# EAGLE design LeCoolStick-MainShield_v1 (EAGLE 7.3.0)
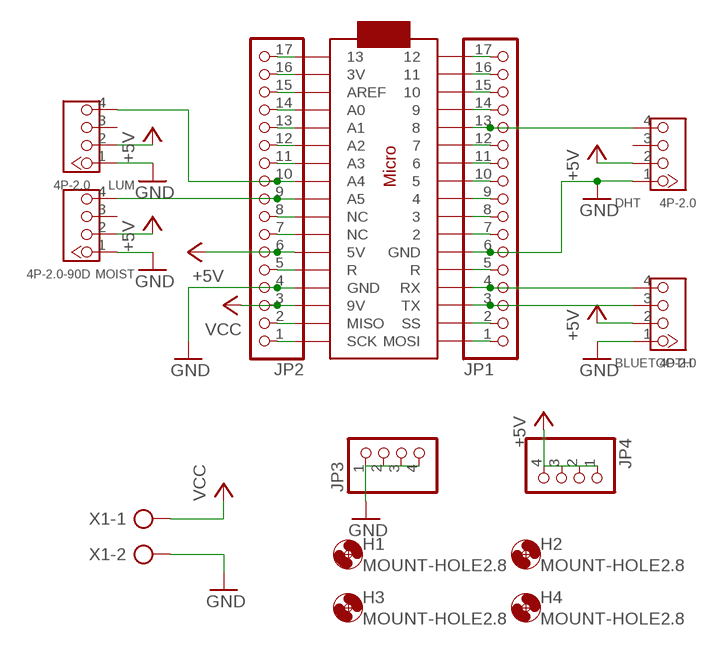
[diagram p0: schematic, sheet 1]

## Parts
BLUETOOTH  4P-2.0  GROVE-CONNECTOR-DIP(4P-2.0)  [HW4-2.0]
DHT  4P-2.0  GROVE-CONNECTOR-DIP(4P-2.0)  [HW4-2.0]
H1  MOUNT-HOLE2.8  [2,8]
H2  MOUNT-HOLE2.8  [2,8]
H3  MOUNT-HOLE2.8  [2,8]
H4  MOUNT-HOLE2.8  [2,8]
JP1  PINHD-1X17  [1X17]
JP2  PINHD-1X17  [1X17]
JP3  PINHD-1X4  [1X04]
JP4  PINHD-1X4  [1X04]
LUM  4P-2.0  GROVE-CONNECTOR-DIP(4P-2.0)  [HW4-2.0]
MOIST  4P-2.0-90D  GROVE-CONNECTOR-DIP-90D(4P-2.0)  [HW4-2.0-90D]
U$1  ARDUINOMICRO  [ARDUINOMICRO]
X1  AK500/2  [AK500/2]

## Nets
+5V: BLUETOOTH.2 DHT.2 JP2.6 JP4.1 JP4.2 JP4.3 JP4.4 LUM.2 MOIST.2 U$1.P$23(5V)
GND: BLUETOOTH.1 DHT.1 JP1.6 JP2.4 JP3.1 JP3.2 JP3.3 JP3.4 LUM.1 MOIST.1 U$1.P$12(GND) U$1.P$21(GND) X1.2
N$1: JP2.9 MOIST.4 U$1.P$26(A5)
N$2: JP2.10 LUM.4 U$1.P$27(A4)
N$3: DHT.4 JP1.13 U$1.P$5
N$4: BLUETOOTH.4 JP1.4 U$1.P$14(RX)
N$5: BLUETOOTH.3 JP1.3 U$1.P$15(TX)
N$6: JP1.1 U$1.P$17(MOSI)
N$7: JP1.2 U$1.P$16(SS)
N$8: JP1.5 U$1.P$22(R)
N$10: JP1.7 U$1.P$11
N$11: JP1.8 U$1.P$10
N$12: JP1.9 U$1.P$9
N$13: JP1.10 U$1.P$8
N$14: JP1.11 U$1.P$7
N$15: JP1.12 U$1.P$6
N$16: JP1.14 U$1.P$4
N$17: JP1.15 U$1.P$3
N$18: JP1.16 U$1.P$2
N$19: JP1.17 U$1.P$1
N$20: JP2.1 U$1.P$18(SCK)
N$21: JP2.2 U$1.P$19(MISO)
N$22: JP2.5 U$1.P$13(R)
N$24: JP2.7 U$1.P$24(NC)
N$25: JP2.8 U$1.P$25(NC)
N$26: JP2.11 U$1.P$28(A3)
N$27: JP2.12 U$1.P$29(A2)
N$28: JP2.13 U$1.P$30(A1)
N$29: JP2.14 U$1.P$31(A0)
N$30: JP2.15 U$1.P$32(AREF)
N$31: JP2.16 U$1.P$33(3V)
N$32: JP2.17 U$1.P$34
VCC: JP2.3 U$1.P$20(9V) X1.1
Unconnected: DHT.3 LUM.3 MOIST.3

## Library data of the parts
BLUETOOTH DHT LUM = Seeed-OPL-Connector:GROVE-CONNECTOR-DIP(4P-2.0): 320110033
H1-H4 = holes:MOUNT-HOLE: MOUNTING HOLE with drill center marker
JP1 JP2 = pinhead:PINHD-1X17: PIN HEADER
JP3 JP4 = pinhead:PINHD-1X4: PIN HEADER
MOIST = Seeed-OPL-Connector:GROVE-CONNECTOR-DIP-90D(4P-2.0): 320110034
U$1 = adafruit:ARDUINOMICRO
X1 = con-ptr500:AK500/2: CONNECTOR; OC_FARNELL: unknown; OC_NEWARK: unknown

## Board
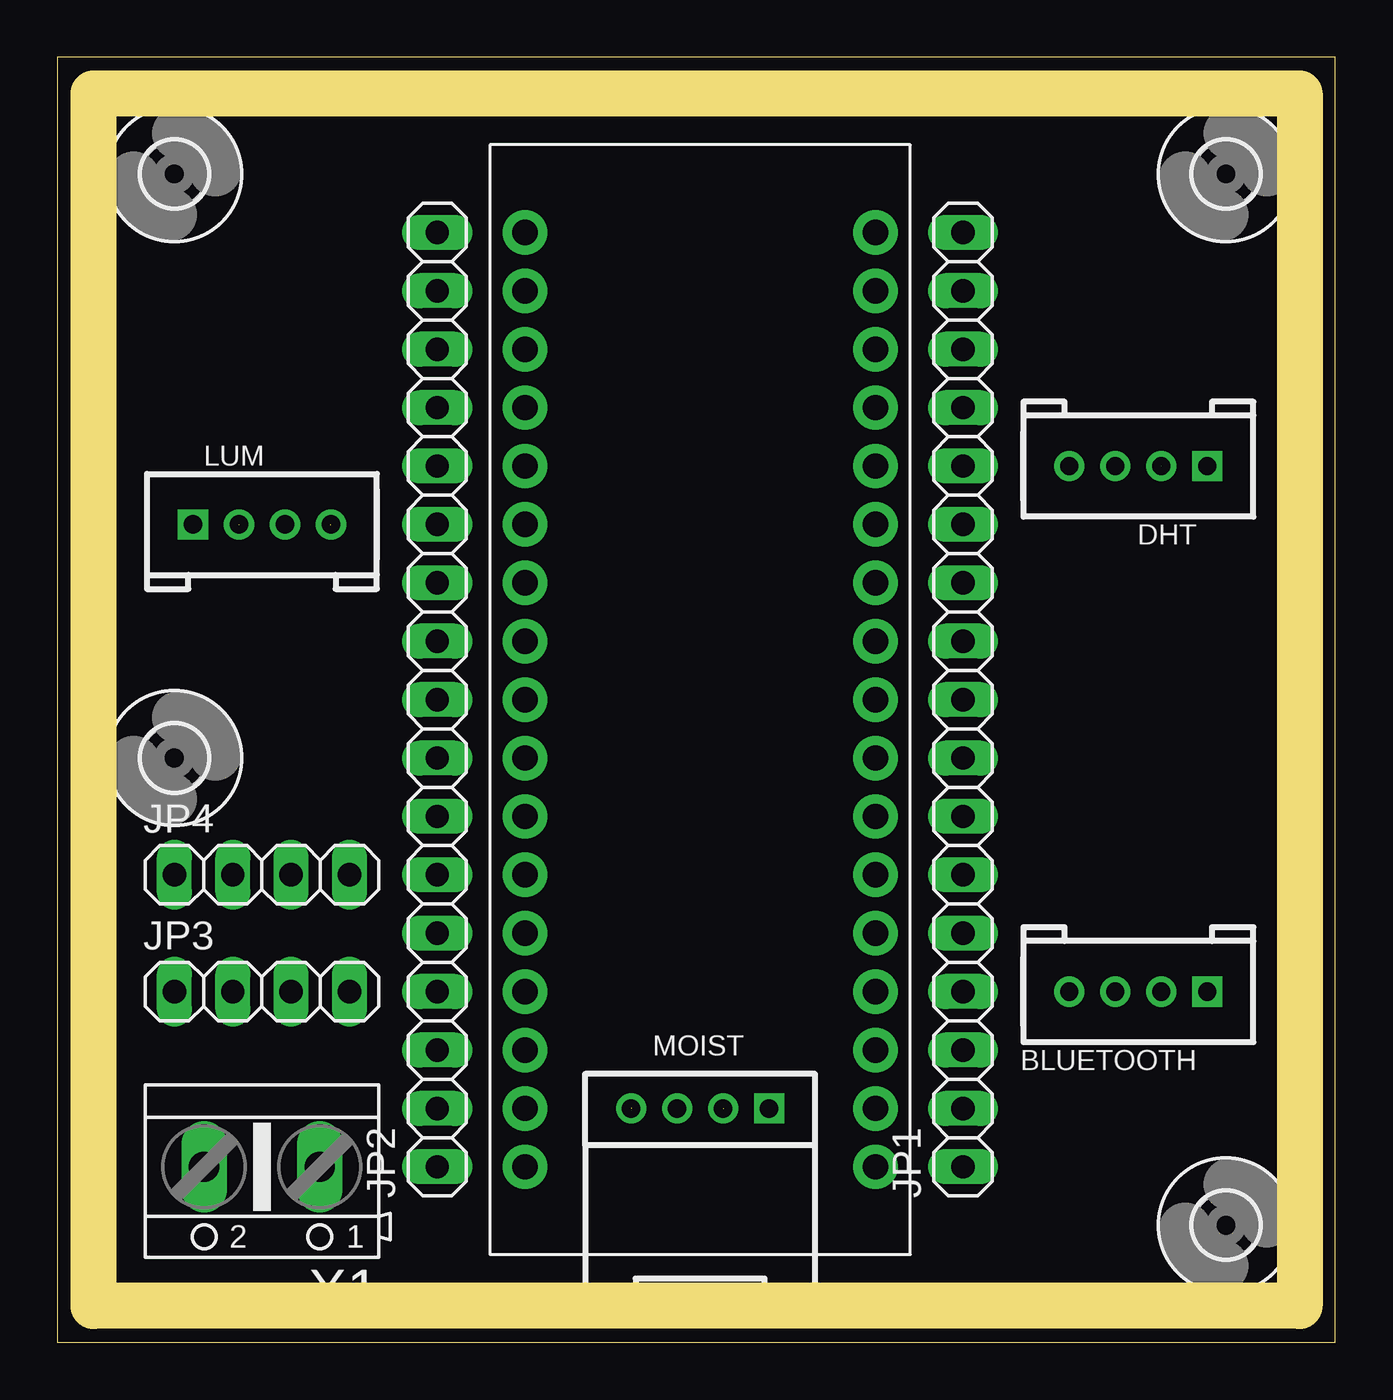
[diagram p1: board, top side]
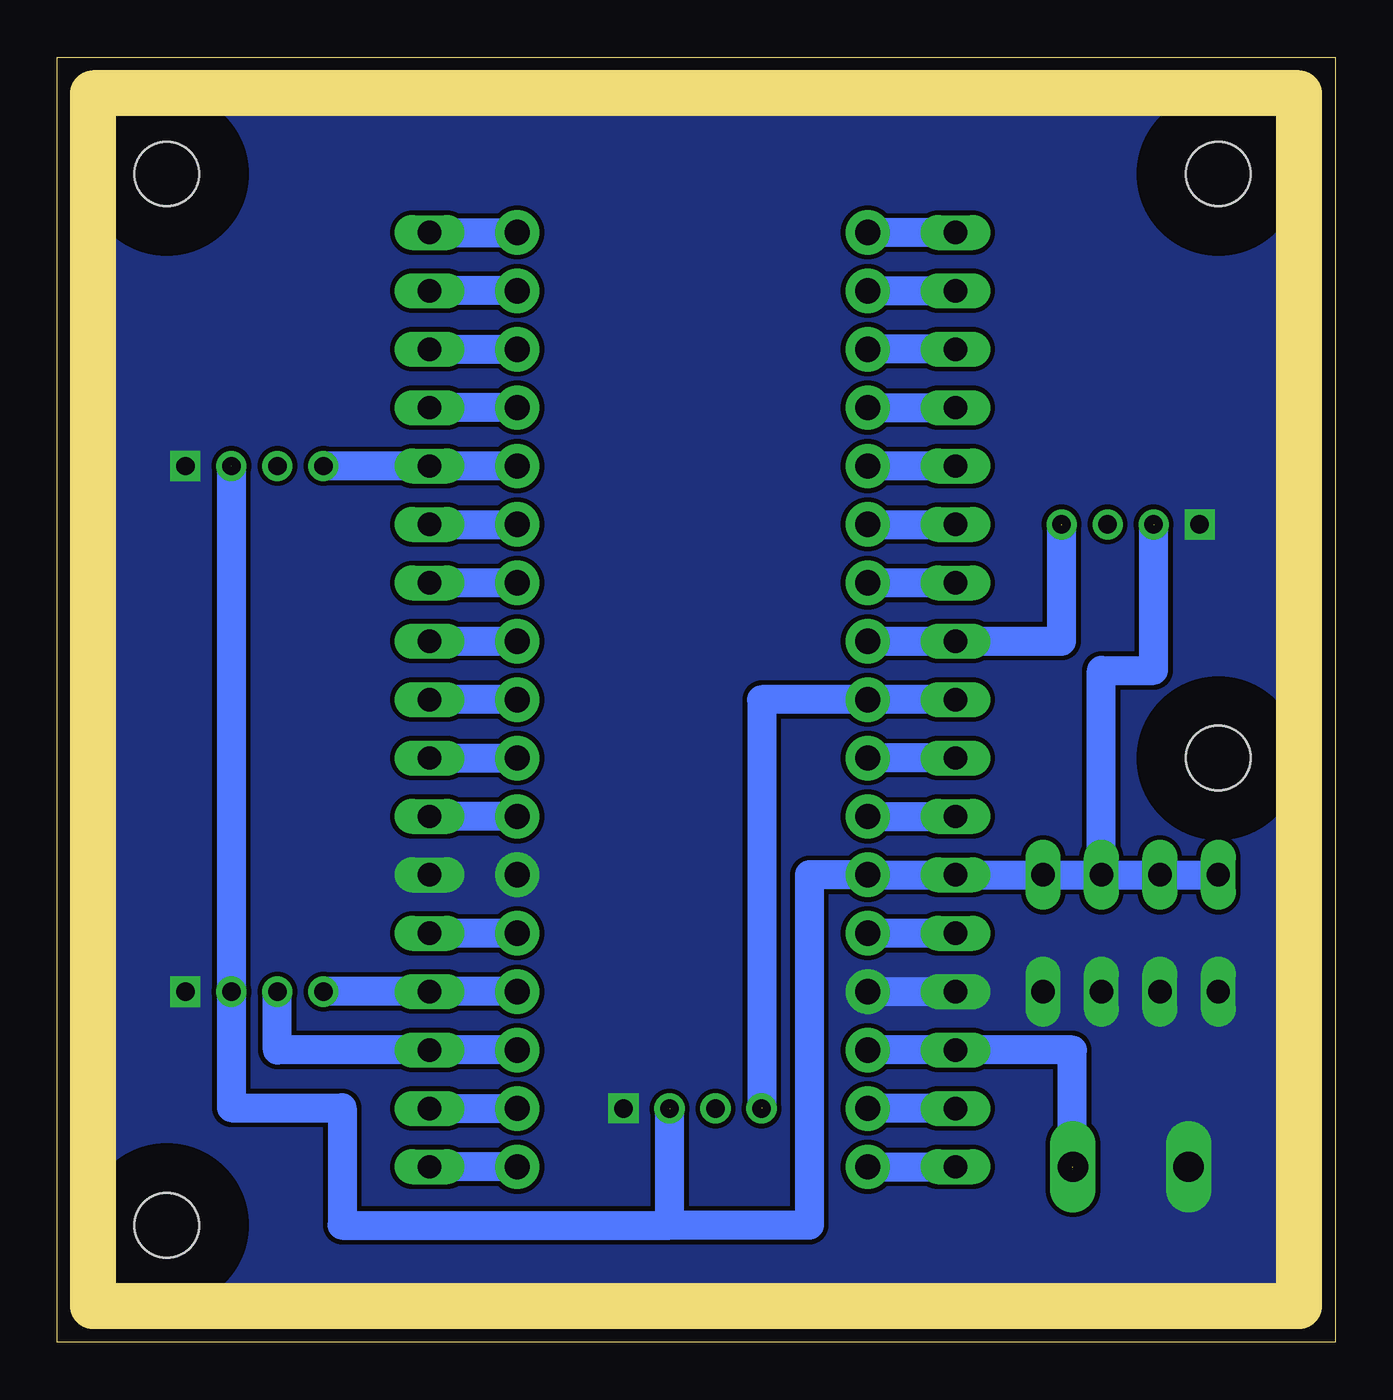
[diagram p2: board, bottom side, seen from below]

Size 55.55 x 55.87 mm. Coordinates in mm from the lower left corner, seen from the top.
Outline: 0,0 55.55,0 55.55,55.87 0,55.87 0,0
Copper layers (1*16): Top 0.035mm / dielectric 1.5mm / Bottom 0.035mm
Design rules "default": minimum track width 10mil, minimum drill 24mil, track to track 8mil, track to pad 8mil, pad to pad 8mil, via to via 8mil, smd to smd 8mil, copper to edge 40mil, drill to drill 8mil, minimum pad ring 10mil, minimum via ring 8mil, stop-mask expansion 4mil, vias tented up to drill 0mil, thermal gap 10mil
Milling: 4 lines

### Footprints (pad centres in the part's own frame; a part is rotated, then mirrored left to right if it is on the bottom)
HW4-2.0 = drill 0.8 pad 1.27 square: 1 -3,0 | drill 0.8 pad 1.27: 2 -1,0; 3 1,0; 4 3,0
2,8 = hole 2.8: 0,0
1X17 = drill 1.016 long: 1 -20.32,0; 2 -17.78,0; 3 -15.24,0; 4 -12.7,0; 5 -10.16,0; 6 -7.62,0; 7 -5.08,0; 8 -2.54,0; 9 0,0; 10 2.54,0; 11 5.08,0; 12 7.62,0; 13 10.16,0; 14 12.7,0; 15 15.24,0; 16 17.78,0; 17 20.32,0
1X04 = drill 1.016 long: 1 -3.81,0; 2 -1.27,0; 3 1.27,0; 4 3.81,0
HW4-2.0-90D = drill 0.8 pad 1.27 square: 1 -3,0 | drill 0.8 pad 1.27: 2 -1,0; 3 1,0; 4 3,0
ARDUINOMICRO = drill 1.1 pad 1.93: P$1 -20.32,7.62; P$2 -17.78,7.62; P$3 -15.24,7.62; P$4 -12.7,7.62; P$5 -10.16,7.62; P$6 -7.62,7.62; P$7 -5.08,7.62; P$8 -2.54,7.62; P$9 0,7.62; P$10 2.54,7.62; P$11 5.08,7.62; P$12 12.7,-7.62; P$13 10.16,-7.62; P$14 12.7,7.62; P$15 15.24,7.62; P$16 17.78,7.62; P$17 20.32,7.62; P$18 20.32,-7.62; P$19 17.78,-7.62; P$20 15.24,-7.62; P$21 7.62,7.62; P$22 10.16,7.62; P$23 7.62,-7.62; P$24 5.08,-7.62; P$25 2.54,-7.62; P$26 0,-7.62; P$27 -2.54,-7.62; P$28 -5.08,-7.62; P$29 -7.62,-7.62; P$30 -10.16,-7.62; P$31 -12.7,-7.62; P$32 -15.24,-7.62; P$33 -17.78,-7.62; P$34 -20.32,-7.62
AK500/2 = drill 1.321 long: 1 -2.515,0; 2 2.515,0

### Placement (x,y rotation side)
BLUETOOTH  46.99,15.24 180 top
DHT  46.99,38.1 180 top
H1  5.08,50.8 0 top
H2  5.08,25.4 0 top
H3  50.8,50.8 0 top
H4  50.8,5.08 0 top
JP1  39.37,27.94 90 top
JP2  16.51,27.94 90 top
JP3  8.89,15.24 0 top
JP4  8.89,20.32 0 top
LUM  8.89,35.56 0 top
MOIST  27.94,10.16 180 top
U$1  27.94,27.94 270 top
X1  8.89,7.62 180 top

### Tracks (layer width: path | path; a pad name or v marks a point on that pad's centre or on a via)
+5V  (3 unrouted)
  Bottom 1.27: U$1.P$23 JP2.6 JP4.4 JP4.3 | JP4.3 JP4.2 JP4.1 | JP4.3 10.16,29.21 7.89,29.21 7.89,35.54 | DHT.2 BLUETOOTH.2 47.99,10.19 43.18,10.19 43.18,5.08 28.94,5.08 | 20.32,20.29 U$1.P$23 | U$1.P$23 22.86,20.32 22.86,5.08 28.94,5.08 | 28.94,5.08 28.94,10.14
GND
  Bottom 1.27: U$1.P$12 JP2.4
  pour Bottom (no thermals): 2.54,54.61 54.61,54.61 54.61,1.27 1.27,1.27 1.27,54.61
N$1  (1 unrouted)
  Bottom 1.27: JP2.9 U$1.P$26 24.94,27.94 24.94,10.19
N$2  (1 unrouted)
  Bottom 1.27: 11.89,35.54 11.89,30.48 JP2.10 U$1.P$27
N$3
  Bottom 1.27: U$1.P$5 JP1.13 DHT.4
N$4
  Bottom 1.27: U$1.P$14 JP1.4 BLUETOOTH.4
N$5
  Bottom 1.27: U$1.P$15 JP1.3 45.99,12.7 BLUETOOTH.3
N$6
  Bottom 1.27: U$1.P$17 JP1.1
N$7
  Bottom 1.27: JP1.2 U$1.P$16
N$8
  Bottom 1.27: U$1.P$22 JP1.5
N$10
  Bottom 1.27: U$1.P$11 JP1.7
N$11
  Bottom 1.27: JP1.8 U$1.P$10
N$12
  Bottom 1.27: U$1.P$9 JP1.9
N$13
  Bottom 1.27: JP1.10 U$1.P$8
N$14
  Bottom 1.27: U$1.P$7 JP1.11
N$15
  Bottom 1.27: JP1.12 U$1.P$6
N$16
  Bottom 1.27: U$1.P$4 JP1.14
N$17
  Bottom 1.27: JP1.15 U$1.P$3
N$18
  Bottom 1.27: U$1.P$2 JP1.16
N$19
  Bottom 1.27: JP1.17 U$1.P$1
N$20
  Bottom 1.27: U$1.P$18 JP2.1
N$21
  Bottom 1.27: JP2.2 U$1.P$19
N$22
  Bottom 1.27: JP2.5 U$1.P$13
N$24
  Bottom 1.27: U$1.P$24 JP2.7
N$25
  Bottom 1.27: JP2.8 U$1.P$25
N$26
  Bottom 1.27: JP2.11 U$1.P$28
N$27
  Bottom 1.27: U$1.P$29 JP2.12
N$28
  Bottom 1.27: JP2.13 U$1.P$30
N$29
  Bottom 1.27: U$1.P$31 JP2.14
N$30
  Bottom 1.27: JP2.15 U$1.P$32
N$31
  Bottom 1.27: U$1.P$33 JP2.16
N$32
  Bottom 1.27: JP2.17 U$1.P$34
VCC  (1 unrouted)
  Bottom 1.27: 11.43,7.62 11.43,12.7 JP2.3 U$1.P$20